# Altium schematic sheet Charger_Interface.SchDoc
size Letter; Organization: Midnight Sun Solar Rayce Car Team; Address1: University of Waterloo; Address2: 200 University Ave W; Address3: Waterloo, ON, Canada; Address4: N2L 3E9; Website: www.uwmidsun.com
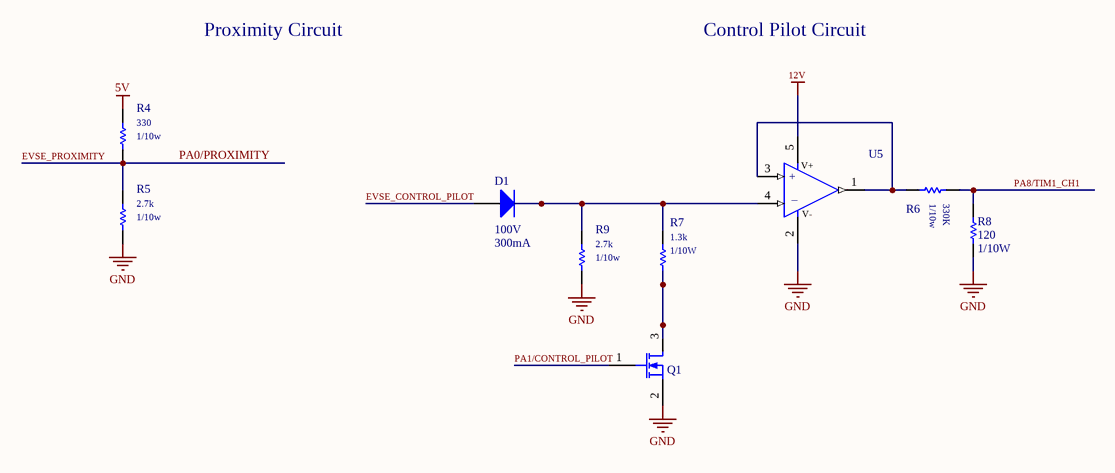
[diagram p0: Charger_Interface.SchDoc]

## Parts
D1  DIODE GEN PURP 100V 300MA SOD123  (value not drawn)
Q1  MOSFET N-CH 30V 6.2A 0.9W SOT-23  [MOSFET N-CH 30V 6.2A 0.9W SOT-23]  (value not drawn)
R4  RES 330 OHM 1% 1/10W 0603  [RES, 0603]  (value not drawn)
R5  RES 2.7K OHM 1% 1/10W 0603  [RES, 0603]  (value not drawn)
R6  RES 330K OHM 1% 1/10W 0603  [RES, 0603]  (value not drawn)
R7  RES 1.3K OHM 1% 1/10W 0603  [RES, 0603]  (value not drawn)
R8  Resistance: 120  Power: 1/10W  [RES, 0603]  (hidden comment: RES 120 OHM 1% 1/10W 0603)
R9  RES 2.7K OHM 1% 1/10W 0603  [RES, 0603]  (value not drawn)
U5  IC OP AMP PREC RRIO 36V SOT23-5  (value not drawn)

## Nets
5V: R4.1
12V: U5.5(V+)
GND: Q1.2(S) R5.2 R8.2 R9.2 U5.2(V-)
EVSE_CONTROL_PILOT: D1.1(A)
EVSE_PROXIMITY: R4.2 R5.1  [also labelled PA0/PROXIMITY]
PA1/CONTROL_PILOT: Q1.1(G)
PA8/TIM1_CH1: R6.1 R8.1
NetD1_2: D1.2(K) R9.1 U5.4(-IN)
NetQ1_3: Q1.3(D) R7.2
NetR6_2: R6.2 U5.1(OUT) U5.3(+IN)

## Notes on the sheet
- Proximity Circuit
- Control Pilot Circuit
- Project:
- Title:
- Size:
- Project Author
- Letter
- Revision:
- University of Waterloo
- 200 University Ave W
- Waterloo, ON, Canada
- N2L 3E9
- Date:
- Sheet
- of
- Website:
- (in symbol IC OP AMP PREC RRIO 36V SOT23-5) +; _
- (in symbol RES 1.3K OHM 1% 1/10W 0603) 1.3k; 1/10W
- (in symbol RES 2.7K OHM 1% 1/10W 0603) 2.7k; 1/10w
- (in symbol RES 330 OHM 1% 1/10W 0603) 330; 1/10w
- (in symbol RES 330K OHM 1% 1/10W 0603) 1/10w; 330K

## Library data of the parts
D1 = DIODE GEN PURP 100V 300MA SOD123: Diode Standard 100V 300mA (DC) Surface Mount SOD-123; Manufacturer: Diodes Zetex; Manufacturer Part Number: 1N4148WQ-7-F; Max Surge Current: 2A; Forward Voltage: 1.25V; Element Configuration: Single; Recovery Time: 4ns; Peak Reverse Current: 50uA; Max Power Dissipation: 400mW; Description: Diode Switching 100V 0.15A Automotive 2-Pin SOD-123 T/R; Supplier 1: Digi-Key; Stock 1: 229; Pricing 1: 1=0.22, 10=0.196, 100=0.107, 500=0.0658, 1000=0.0449 (USD); Mount: Surface Mount; Case/Package: SOD-123-2; Number of Pins: 2; Weight: 0.000353oz; Contact Plating: Tin,Matte; Min Operating Temperature: -65°C; Max Operating Temperature: 150°C; Packaging: Tape and Reel; Peak Non-Repetitive Surge Current: 2A; Forward Current: 300mA; Package Quantity: 3000; Reverse Recovery Time: 4ns; Max Repetitive Reverse Voltage (Vrrm): 100V; Lead Free: Lead Free; ComponentLink1URL: http://components.arrow.com/part/dataview/0323_07206809; ComponentLink1Description: http://components.arrow.com/part/dataview/0323_07206809; ComponentLink2URL: http://www.diodes.com/datasheets/ds30086.pdf; ComponentLink2Description: http://www.diodes.com/datasheets/ds30086.pdf; ComponentLink3URL: http://www.mouser.com/ds/2/115/ds30086-318161.pdf; ComponentLink3Description: http://www.mouser.com/ds/2/115/ds30086-318161.pdf; Supplier Part Number 1: 1N4148WQ-7-FDICT-ND
Q1 = MOSFET N-CH 30V 6.2A 0.9W SOT-23: N-Channel 30V 6.2A (Ta) 900mW (Ta) Surface Mount SOT-23; Manufacturer: Diodes; Manufacturer Part Number: DMN3023L-7; Rds On Max: 25mR; Input Capacitance: 873pF; Supplier 1: Digi-Key; Stock 1: 38246; Pricing 1: 1=0.47, 10=0.368, 100=0.2529, 500=0.1734, 1000=0.1301 (USD); Mount: Surface Mount; Case/Package: TO-236-3; Min Operating Temperature: -55°C; Max Operating Temperature: 150°C; Packaging: Tape and Reel; Drain to Source Voltage (Vdss): 30V; Continuous Drain Current (ID): 6.2A; Max Power Dissipation: 900mW; ComponentLink1URL: https://www.diodes.com/assets/Datasheets/DMN3023L.pdf; ComponentLink1Description: https://www.diodes.com/assets/Datasheets/DMN3023L.pdf; ComponentLink2URL: http://www.mouser.com/ds/2/115/DMN3023L-959533.pdf; ComponentLink2Description: http://www.mouser.com/ds/2/115/DMN3023L-959533.pdf; Supplier Part Number 1: DMN3023L-7DICT-ND
R4 = RES 330 OHM 1% 1/10W 0603: 330 Ohms ±1% 0.1W, 1/10W Chip Resistor 0603 (1608 Metric) Automotive AEC-Q200, Moisture Resistant Thick Film; Manufacturer: TE Connectivity; Manufacturer Part Number: 1-2176339-9; Supplier 1: Digi-Key; Stock 1: 0; Supplier Part Number 1: A129682TR-ND
R5 R9 = RES 2.7K OHM 1% 1/10W 0603: 2.7 kOhms ±1% 0.1W, 1/10W Chip Resistor 0603 (1608 Metric) Automotive AEC-Q200, Moisture Resistant Thick Film; Manufacturer: TE Connectivity; Manufacturer Part Number: 3-2176339-0; Stock 1: 0; Supplier 1: Digi-Key; Supplier Part Number 1: A129693TR-ND
R6 = RES 330K OHM 1% 1/10W 0603: 330 kOhms ±1% 0.1W, 1/10W Chip Resistor 0603 (1608 Metric) Moisture Resistant Thick Film; Manufacturer: Yageo Phycomp; Manufacturer Part Number: RC0603FR-07330KL; Power Rating: 100mW; Temperature Coefficient: 100ppm/°C; Voltage Rating (DC): 50V; Resistance: 330kR; Working Voltage: 75V; Supplier 1: Digi-Key; Stock 1: 285000; Pricing 1: 1=0.1, 10=0.015, 100=0.006, 1000=0.0027, 2500=0.0023 (USD); Mount: Surface Mount; Case/Package: 0603; Number of Pins: 2; Min Operating Temperature: -55°C; Max Operating Temperature: 155°C; Tolerance: 1%; Packaging: Cut Tape; Number of Terminations: 2; Length: 1.6mm; Height: 0.45mm; Depth: 0.8mm; Width: 800um; REACH SVHC: No SVHC; Lead Free: Lead Free; ComponentLink1URL: http://documents.rs-components.com/techlib://itc_doclist_GB.htm?stockno=5046528; ComponentLink1Description: http://documents.rs-components.com/techlib://itc_doclist_GB.htm?stockno=5046528; ComponentLink2URL: http://www.mouser.com/ds/2/447/RC0603-272842.pdf; ComponentLink2Description: http://www.mouser.com/ds/2/447/RC0603-272842.pdf; ComponentLink3URL: http://www.yageo.com/documents/recent/PYu-RC0603_51_RoHS_L_v5.pdf; ComponentLink3Description: http://www.yageo.com/documents/recent/PYu-RC0603_51_RoHS_L_v5.pdf; ComponentLink4URL: http://www.yageo.com.tw/exep/pages/download/literatures/PYu-R_INT-thick_7.pdf; ComponentLink4Description: http://www.yageo.com.tw/exep/pages/download/literatures/PYu-R_INT-thick_7.pdf; Supplier Part Number 1: 311-330KHRCT-ND
R7 = RES 1.3K OHM 1% 1/10W 0603: 1.3 kOhms ±1% 0.1W, 1/10W Chip Resistor 0603 (1608 Metric) Moisture Resistant Thick Film; Manufacturer: Yageo; Manufacturer Part Number: RC0603FR-071K3L; Resistance: 1.3kR; Power Rating: 100mW; Voltage Rating: 50V; Temperature Coefficient: 100ppm/°C; Working Voltage: 75V; Supplier 1: Digi-Key; Stock 1: 57984; Pricing 1: 1=0.1, 10=0.015, 100=0.006, 1000=0.0027, 2500=0.0023 (USD); Case/Package: 0603; Case Code (Imperial): 0603; Case Code (Metric): 1608; Min Operating Temperature: -55°C; Max Operating Temperature: 155°C; Tolerance: 1%; Packaging: Tape and Reel; Termination: SMD/SMT; Composition: Thick Film; Military Standard: Not; Voltage Rating (DC): 50V; Number of Terminations: 2; Length: 1.6mm; Depth: 0.8mm; Width: 800um; Lead Free: Lead Free; ComponentLink1URL: http://components.arrow.com/part/dataview/0323_00200771; ComponentLink1Description: http://components.arrow.com/part/dataview/0323_00200771; ComponentLink2URL: http://www.mouser.com/ds/2/447/RC0603-272842.pdf; ComponentLink2Description: http://www.mouser.com/ds/2/447/RC0603-272842.pdf; ComponentLink3URL: http://www.yageo.com.tw/exep/pages/download/literatures/PYu-R_INT-thick_7.pdf; ComponentLink3Description: http://www.yageo.com.tw/exep/pages/download/literatures/PYu-R_INT-thick_7.pdf; ComponentLink4URL: http://www.yageo.com/documents/recent/PYu-RC0603_51_RoHS_L_v5.pdf; ComponentLink4Description: http://www.yageo.com/documents/recent/PYu-RC0603_51_RoHS_L_v5.pdf; Supplier Part Number 1: 311-1.30KHRCT-ND
R8 = RES 120 OHM 1% 1/10W 0603: RES SMD 120 OHM 1% 1/10W 0603; Manufacturer 1: Yageo; Manufacturer Part Number 1: RC0603FR-07120RL; Temperature Coefficient: ±100ppm/°C; Supplier 1: Digi-Key; Supplier Part Number 1: 311-120HRCT-ND; Packaging: Cut Tape (CT); Part Status: Active; Composition: Thick Film; Operating Temperature: -55°C ~ 155°C; Package / Case: 0603 (1608 Metric); Supplier Device Package: 0603; Size / Dimension: 0.063" L x 0.031" W (1.60mm x 0.80mm); Height - Seated (Max): 0.022" (0.55mm); Failure Rate: -; ComponentLink1URL: http://www.yageo.com/documents/recent/PYu-RC_Group_51_RoHS_L_7.pdf; ComponentLink1Description: http://www.yageo.com/documents/recent/PYu-RC_Group_51_RoHS_L_7.pdf; Tolerance: ±1%
U5 = IC OP AMP PREC RRIO 36V SOT23-5: Manufacturer: Texas Instruments; Manufacturer Part Number: OPA197IDBVT; Number of Circuits: 1; Slew Rate: 20V/µs; Gain Bandwidth Product: 10MHz; Input Bias Current: 5pA; Input Offset Voltage (Vos): 25uV; Operating Supply Current: 1mA; Output Current per Channel: 65mA; Supplier 1: Digi-Key; Stock 1: 5477; Pricing 1: 1=1.84, 10=1.657, 100=1.3317 (USD); Mount: Surface Mount; Case/Package: SOT-23; Number of Pins: 5; Min Operating Temperature: -40°C; Max Operating Temperature: 125°C; Packaging: Cut Tape; Bandwidth: 10MHz; Number of Amplifiers: 1; Number of Channels: 1; REACH SVHC: No SVHC; Lead Free: Lead Free; ComponentLink1URL: http://www.ti.com/lit/ds/symlink/opa197.pdf; ComponentLink1Description: http://www.ti.com/lit/ds/symlink/opa197.pdf; ComponentLink2URL: http://www.ti.com/lit/gpn/opa197; ComponentLink2Description: http://www.ti.com/lit/gpn/opa197; ComponentLink3URL: http://www.ti.com/general/docs/lit/getliterature.tsp?genericPartNumber=OPA197&&fileType=pdf; ComponentLink3Description: http://www.ti.com/general/docs/lit/getliterature.tsp?genericPartNumber=OPA197&&fileType=pdf; Supplier Part Number 1: 296-44076-1-ND